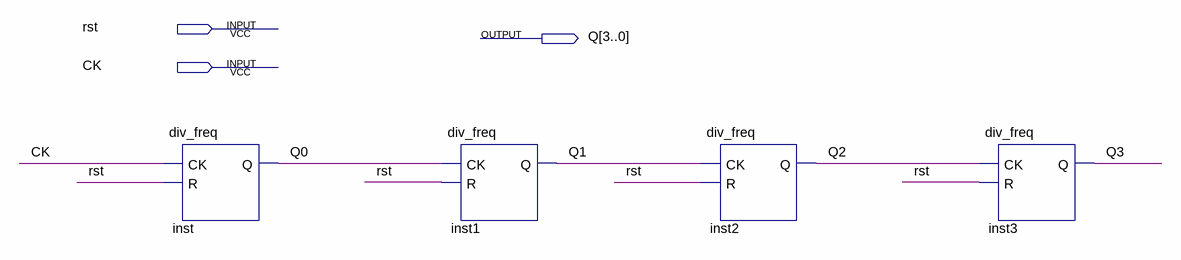
[diagram p0: schematic sheet]
// Quartus schematic clock_lab.bdf as structural Verilog: 4 symbols, 3 pins
module clock_lab (
  input  rst,
  input  CK,
  output [3:0] Q
);

  div_freq inst (.CK(CK), .R(rst), .Q(Q[0]));
  div_freq inst1 (.CK(Q[0]), .R(rst), .Q(Q[1]));
  div_freq inst2 (.CK(Q[1]), .R(rst), .Q(Q[2]));
  div_freq inst3 (.CK(Q[2]), .R(rst), .Q(Q[3]));
endmodule
